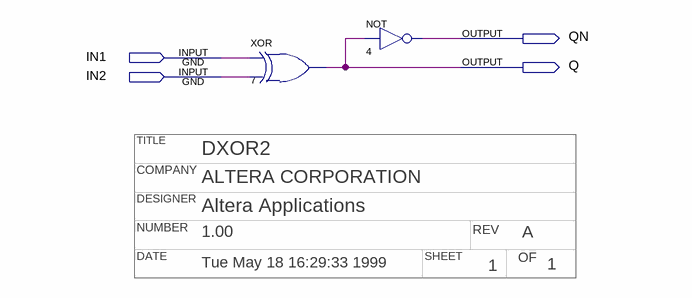
[diagram p0: schematic sheet]
// Quartus schematic dxor2.bdf as structural Verilog: 2 symbols, 4 pins
// Title block: TITLE: DXOR2; COMPANY: ALTERA CORPORATION; DESIGNER: Altera Applications; NUMBER: 1.00; REV: A; DATE: Tue May 18 16:29:33 1999; SHEET: 1; OF: 1
module dxor2 (
  input  IN1,
  input  IN2,
  output QN,
  output Q
);

  xor u_7 (Q, IN1, IN2);
  not u_4 (QN, Q);
endmodule
